# Altium schematic sheet Transfer Circuit.schdoc
size 135 x 81 mm
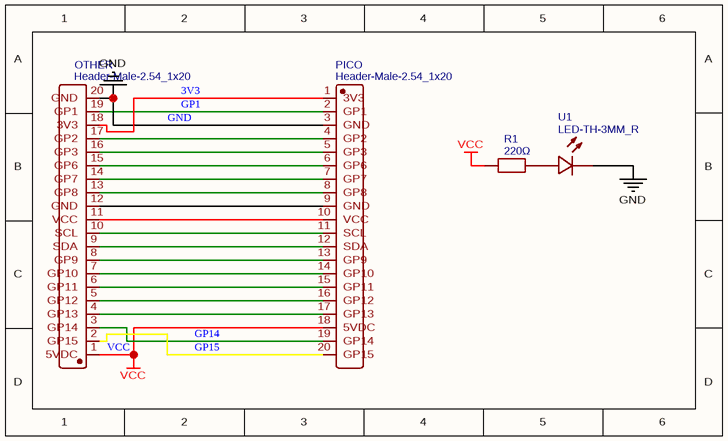
[diagram p0: Transfer Circuit.schdoc]

## Parts
OTHER  Header-Male-2.54_1x20  [HDR-TH_20P-P2.54-V-M-1]
PICO  Header-Male-2.54_1x20  [HDR-TH_20P-P2.54-V-M-1]
R1  220Ω  [RES-TH_BD2.3-L6.5-P10.50-D0.5]
U1  LED-TH-3MM_R  [LED-TH_BD5.4-P2.54-FD_RED]

## Nets
GND: OTHER.20(GND) PICO.3(GND) U1.2
VCC: OTHER.1(5VDC) PICO.18(5VDC) R1.1
3V3: OTHER.18(3V3) PICO.1(3V3)
GP1: OTHER.19(GP1) PICO.2(GP1)
GP14: OTHER.3(GP14) PICO.19(GP14)
GP15: OTHER.2(GP15) PICO.20(GP15)
NetOTHER_4: OTHER.4(GP13) PICO.17(GP13)
NetOTHER_5: OTHER.5(GP12) PICO.16(GP12)
NetOTHER_6: OTHER.6(GP11) PICO.15(GP11)
NetOTHER_7: OTHER.7(GP10) PICO.14(GP10)
NetOTHER_8: OTHER.8(GP9) PICO.13(GP9)
NetOTHER_9: OTHER.9(SDA) PICO.12(SDA)
NetOTHER_10: OTHER.10(SCL) PICO.11(SCL)
NetOTHER_11: OTHER.11(VCC) PICO.10(VCC)
NetOTHER_12: OTHER.12(GND) PICO.9(GND)
NetOTHER_13: OTHER.13(GP8) PICO.8(GP8)
NetOTHER_14: OTHER.14(GP7) PICO.7(GP7)
NetOTHER_15: OTHER.15(GP6) PICO.6(GP6)
NetOTHER_16: OTHER.16(GP3) PICO.5(GP3)
NetOTHER_17: OTHER.17(GP2) PICO.4(GP2)
NetR1_2: R1.2 U1.1

## Library data of the parts
OTHER PICO = Header-Male-2.54_1x20: Manufacturer: BOOMELE(博穆精密); Supplier: LCSC; Supplier Part: C50981; JLCPCB Part Class: Extended Part; spicePre: J; spiceSymbolName: Header-Male-2.54_1x20
R1 = 220Ω: Manufacturer: Huaxing Mechanical-Elec.; Manufacturer Part: MF1/4W-20KΩ±1%T52; nameAlias: Resistance (Ohms); Contributor: LCSC; Resistance: 20kΩ; Supplier: LCSC; Supplier Part: C714021; JLCPCB Part Class: Extended Part; spicePre: R; spiceSymbolName: MF1/4W-20KΩ±1%T52
U1 = LED-TH-3MM_R: Manufacturer: null; Contributor: LCSC; Supplier: LCSC; Supplier Part: C9900003210; JLCPCB Part Class: Extended Part; spicePre: U; spiceSymbolName: LED-TH-3MM_R